# EasyEDA schematic ABL Covid Test UI Module.json
TITLE: Sheet_1; REV: 1.0; Date: 2020-08-31; Sheet: 1/1; Company: Your Company
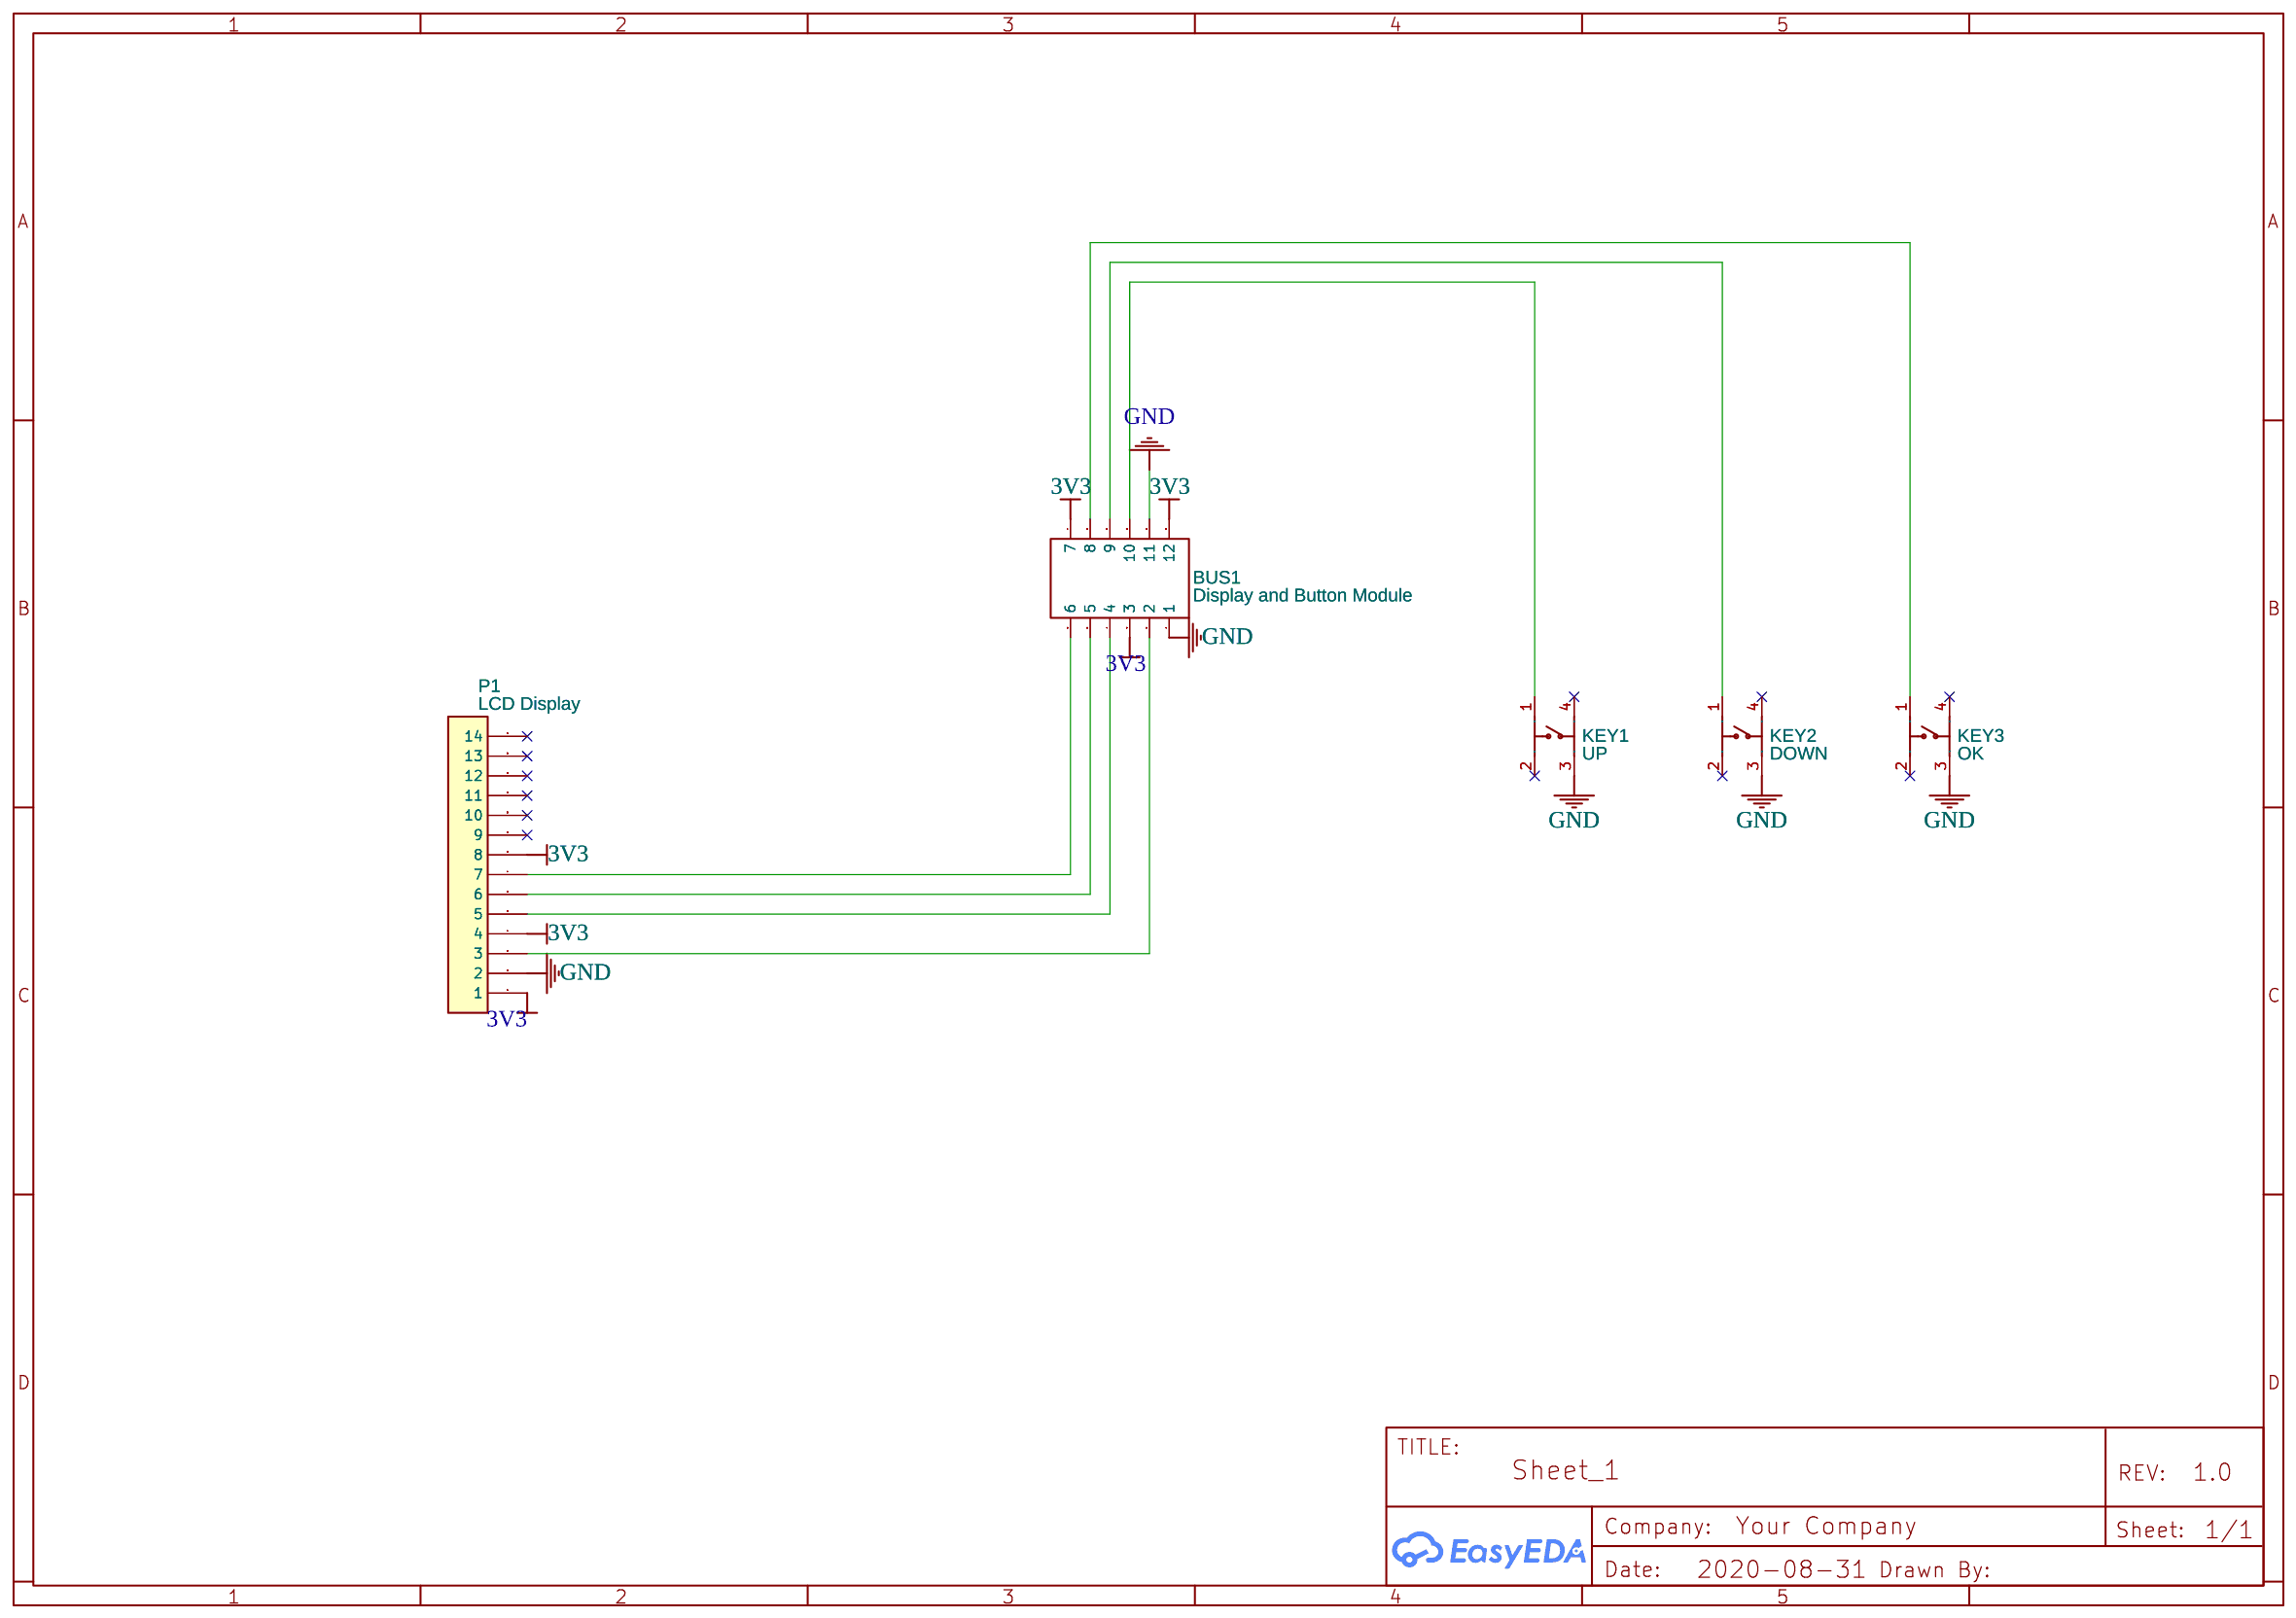
[diagram p0: schematic sheet]

## Parts
BUS1  Display and Button Module  [2X6 12P 2.54]
KEY1  UP  [KEY-TH_4P-L6.0-W6.0-P4.50-LS7.5]
KEY2  DOWN  [KEY-TH_4P-L6.0-W6.0-P4.50-LS7.5]
KEY3  OK  [KEY-TH_4P-L6.0-W6.0-P4.50-LS7.5]
P1  LCD Display  [HDR2X14]

## Library data of the parts
BUS1 = 12p 2x6 header: Contributor: GonzoG
KEY1-KEY3 = button6*6*8: Supplier Part: C59982; Supplier: LCSC; Manufacturer: ReliaPro; image: http://image.lceda.cn/szlcsc/C59982.jpg
P1 = HEADER 14X1: Header, 14-Pin

## Nets
3V3: BUS1.3 BUS1.7 BUS1.12 P1.1 P1.4 P1.8
GND: BUS1.1 BUS1.11 KEY1.3 KEY2.3 KEY3.3 P1.2
Net-(BUS1-2): BUS1.2 P1.3
Net-(BUS1-4): BUS1.4 P1.5
Net-(BUS1-5): BUS1.5 P1.6
Net-(BUS1-6): BUS1.6 P1.7
Net-(BUS1-8): BUS1.8 KEY3.1
Net-(BUS1-9): BUS1.9 KEY2.1
Net-(BUS1-10): BUS1.10 KEY1.1

Not connected (* = marked no-connect by the designer): KEY1 2* 4*; KEY2 2* 4*; KEY3 2* 4*; P1 9* 10* 11* 12* 13* 14*
